# Altium schematic sheet SH1 - POWER.SchDoc: Power
size B; CheckedBy: Lance Bantoto; Author: Aidan Gratton; DrawnBy: Aidan Gratton; Engineer: Aidan Gratton; Organization: UW Robotics; Address1: 200 University Avenue; Address2: Waterloo; Address3: Ontario; Address4: Canada N2L 3G6; Revision: 2; SheetNumber: 1; SheetTotal: 6
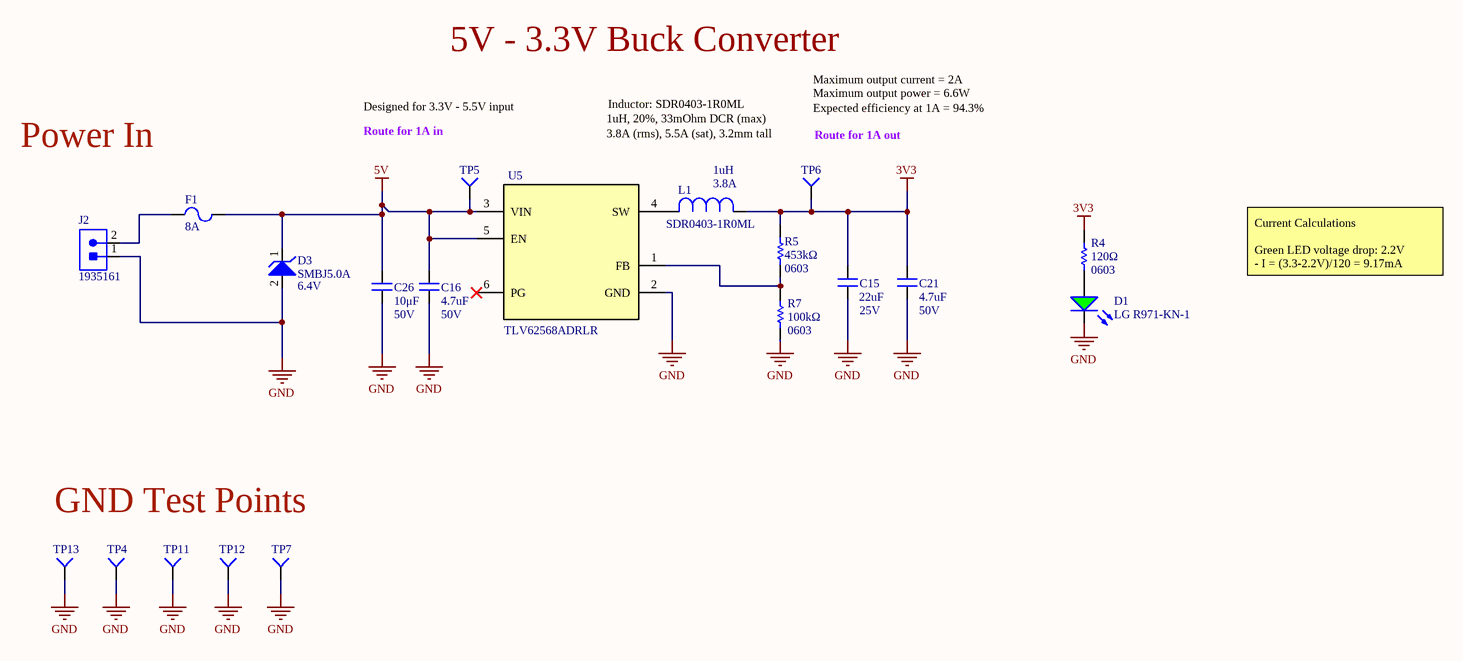
[diagram p0: SH1 - POWER.SchDoc]

## Parts
C15  Voltage: 25V  Capacitance: 22uF  [CAPC3225X270N]  (hidden comment: CAP_22uF_25V_1210)
C16  Capacitance: 4.7uF  Voltage: 50V  [CAP1206]  (hidden comment: CAP_4.7uF_50V_1206)
C21  Capacitance: 4.7uF  Voltage: 50V  [CAP1206]  (hidden comment: CAP_4.7uF_50V_1206)
C26  value 10μF  Voltage Rating: 50V  [CAP1206]  (hidden comment: CAP_10uF_50V_1206)
D1  Manufacturer Part Number 1: LG R971-KN-1  [LED_0805_GREEN]  (hidden comment: DIO_LED_G)
D3  Reverse Breakdown Voltage: 6.4V  [SMBJ5.0A]  (hidden comment: TVS_DIODE_UNIDIR_5V)
F1  Current Rating: 8A  [FUSE_1206]  (hidden comment: FUSE_8A_1206)
J2  CON_2M_TERM  [1935161]  (value not drawn)
L1  value 1uH  Manufacturer Part Number 1: SDR0403-1R0ML  Current Rating: 3.8A  [IND_BOURNS_SDR04]  (hidden comment: IND_1uH_3.8A)
R4  value 120Ω  Package/Footprint: 0603  [RESC0603]  (hidden comment: RES_120Ω_0603)
R5  value 453kΩ  Package/Footprint: 0603  [RESC0603]  (hidden comment: RES_453kΩ_0603_1%)
R7  value 100kΩ  Package/Footprint: 0603  [RESC0603(1608)_N]  (hidden comment: RES_100kΩ_0603_1%)
TP4  TESTPOINT_1MM_SQUARE  [TESTPOINT_SQUARE_1MM]  (value not drawn)  (no BOM)
TP5  TESTPOINT_SMD_LOOP  [S1751-46R]  (value not drawn)
TP6  TESTPOINT_SMD_LOOP  [S1751-46R]  (value not drawn)
TP7  TESTPOINT_1MM_SQUARE  [TESTPOINT_SQUARE_1MM]  (value not drawn)  (no BOM)
TP11  TESTPOINT_1MM_SQUARE  [TESTPOINT_SQUARE_1MM]  (value not drawn)  (no BOM)
TP12  TESTPOINT_1MM_SQUARE  [TESTPOINT_SQUARE_1MM]  (value not drawn)  (no BOM)
TP13  TESTPOINT_SMD_LOOP  [S1751-46R]  (value not drawn)
U5  TLV62568ADRLR  [SOT50P160X60-6N]

## Nets
3V3: C15.2 C21.2 L1.2 R4.2 R5.2 TP6.1(=value)
5V: C16.2 C26.2 D3.1 F1.2 TP5.1(=value) U5.3(VIN) U5.5(EN)
GND: C15.1 C16.1 C21.1 C26.1 D1.2(K) D3.2 J2.1 R7.1 TP4.1(=value) TP7.1(=value) TP11.1(=value) TP12.1(=value) TP13.1(=value) U5.2(GND)
NetD1_1: D1.1(A) R4.1
NetF1_1: F1.1 J2.2
NetL1_1: L1.1 U5.4(SW)
NetR5_1: R5.1 R7.2 U5.1(FB)

Not connected (* = marked no-connect by the designer): U5 6(PG)*

## Notes on the sheet
- 5V - 3.3V Buck Converter
- Maximum output current = 2A
- Power In
- Designed for 3.3V - 5.5V input
- (near TP5) Route for 1A in
- 1uH, 20%, 33mOhm DCR (max)
- 3.8A (rms), 5.5A (sat), 3.2mm tall
- Inductor: SDR0403-1R0ML
- Maximum output power = 6.6W
- Expected efficiency at 1A = 94.3%
- (near TP6) Route for 1A out
- Current Calculations
  Green LED voltage drop: 2.2V
  - I = (3.3-2.2V)/120 = 9.17mA
- GND Test Points
- Title:
- Project:
- Date:
- Rev:
- Checker:
- Engineer:
- Sheet:
- of

## Library data of the parts
C15 = CAP_22uF_25V_1210: CAP CER 22UF 25V X7R 1210; Manufacturer 1: Murata Electronics; Manufacturer Part Number 1: GRM32ER71E226ME15K; Package/Footprint: 1210; Supplier 1: Digi-Key; Supplier Part Number 1: 490-14682-1-ND; Temperature Coefficient: X7R; Mounting Type: SMD
C16 = CAP_4.7uF_50V_1206: CAP CER 4.7UF 50V X7R 1206; Manufacturer Part Number 1: GRM31CR71H475KA12L; Manufacturer 1: Murata; Package/Footprint: 1206; Supplier Part Number 1: 490-6521-1-ND; Supplier 1: Digi-Key; Dielectric: X7R; Mounting Type: SMD
C21 = CAP_4.7uF_50V_1206: CAP CER 4.7UF 50V X7R 1206; Manufacturer 1: Murata; Manufacturer Part Number 1: GRM31CR71H475KA12L; Package/Footprint: 1206; Supplier 1: Digi-Key; Dielectric: X7R; Supplier Part Number 1: 490-6521-1-ND; Mounting Type: SMD
C26 = CAP_10uF_50V_1206: CAP CER 10UF 50V X5R 1206; Manufacturer Part Number 1: GRT31CR61H106KE01L; Manufacturer 1: Murata; Package/Footprint: 1206; Dimensions: 0.126" L x 0.063" W (3.20mm x 1.6mm); Package: 1206 (3216 Metric); Supplier Part Number 1: 490-12456-1-ND; Supplier 1: Digi-Key; Dielectric: X5R; Manufacturer Part Numer 1: GRT31CR61H106KE01L; Mounting Type: SMD
D1 = DIO_LED_G: LED GREEN DIFFUSED 0805 SMD; Manufacturer 1: OSRAM; Forward Voltage Drop: 2.2V; Package/Footprint: 0805; Supplier Part Number 1: 475-1410-1-ND; Supplier 1: Digi-Key; Mounting Type: SMD
D3 = TVS_DIODE_UNIDIR_5V: TVS DIODE 5V 9.2V DO214AA; Manufacturer 1: Bourns; Max Power Dissipation: 600W; Polarity: Unidirectional; Leakage Current: 800uA; Max Surge Current: 100A; Breakdown Voltage: 7.25V; Peak Pulse Current: 65.2A; Test Current: 10mA; Number of Channels: 1; Operating Supply Voltage: 3.5V; Power Line Protection: No; Package/Footprint: SMB; Supplier 1: Digi-Key; Number of Pins: 2; Min Operating Temperature: -55°C; Max Operating Temperature: 150°C; Reverse Standoff Voltage: 5V; Min Breakdown Voltage: 6.4V; Clamping Voltage: 9.2V; Peak Pulse Power: 600W; Max Breakdown Voltage: 7.25V; Max Reverse Leakage Current: 800uA; Supplier Part Number 1: SMBJ5.0ABCT-ND; Manufacturer Part Number 1: SMBJ5.0A; Mounting Type: SMD
F1 = FUSE_8A_1206: FUSE SMD 8A 24V; Manufacturer 1: Littelfuse; Manufacturer Part Number 1: 1206SFF800F/24-2; Package/Footprint: 1206; Supplier 1: Digi-Key; Supplier Part Number 1: 1206SFF800F/24-2CT-ND; Mounting Type: SMD; LCSC Part #: C311032
J2 = CON_2M_TERM: TERM BLK 2POS SIDE ENTRY 5MM; Manufacturer 1: Phoenix Contact; Max Current Rating: 16A; Current: 18A; Voltage: 300V; Package/Footprint: SMD; Supplier 1: Digi-Key; Supplier Part Number 1: 277-1667-ND; Manufacturer Part Number 1: 1935161; Mounting Type: TH
L1 = IND_1uH_3.8A: FIXED IND 1UH 3.8A 33 MOHM SMD; Manufacturer 1: Bourns Inc.; Tolerance: ±20%; Supplier Part Number 1: SDR0403-1R0MLCT-ND; Supplier 1: Digi-Key; Mounting Type: SMD; Package/Footprint: SMD
R4 = RES_120Ω_0603_5%: RES 120 OHM 5% 1/10W 0603; Manufacturer 1: Yageo; Manufacturer Part Number 1: RC0603JR-07120RL; Package: 0603 (1608 Metric); Supplier Part Number 1: 311-120GRCT-ND; Supplier 1: Digi-Key; Mounting Type: SMD
R5 = RES_453kΩ_0603_1%: RES 453K OHM 1% 1/10W 0603; Manufacturer 1: Panasonic Electronic Components; Manufacturer Part Number 1: ERJ-3EKF4533V; Package: 0603 (1608 Metric); Dimensions: 0.063" L x 0.031" W (1.60mm x 0.80mm); Supplier Part Number 1: P453KHCT-ND; Supplier 1: Digi-Key; Case Code (Metric): 1608; Tolerance: 1%; Mounting Type: SMD
R7 = RES_100kΩ_0603_1%: RES 100K OHM 1% 1/10W 0603; Manufacturer 1: Yageo; Manufacturer Part Number 1: RC0603FR-07100KL; Supplier Part Number 1: 311-100KHRCT-ND; Supplier 1: Digi-Key; Tolerance: 1%; Mounting Type: SMD
TP4 TP7 TP11 TP12 = TESTPOINT_1MM_SQUARE: TESTPOINT 1MM SQUARE; Part Number (MPN): *
TP5 TP6 TP13 = TESTPOINT_SMD_LOOP: PC TEST POINT SMD; Manufacturer 1: Harwin; Supplier 1: Digi-Key; Manufacturer Part Number 1: S1751-46R; Supplier Part Number 1: 952-1478-1-ND; Mounting Type: SMD; Package/Footprint: SMD
U5 = TLV62568ADRLR: IC REG BUCK ADJUSTABLE 2A SOT563; Manufacturer 1: Texas Instruments; Vin (Min): 2.5V; Vin (Max): 5.5V; Vout (Min/Fixed): 0.6V; Iout: 1A; Switching Frequency: 1.5MHz; Package/Footprint: SOT-563; Manufacturer Part Number 1: TLV62568ADRLR; Supplier 1: Digi-Key; Supplier Part Number 1: 296-50407-1-ND; Vout (Max): 5.5V; Iout (Max): 2A; Mounting Type: SMD